# Altium schematic sheet Main.SchDoc
size A3; DocumentNumber: 1; SheetNumber: 1; SheetTotal: 11
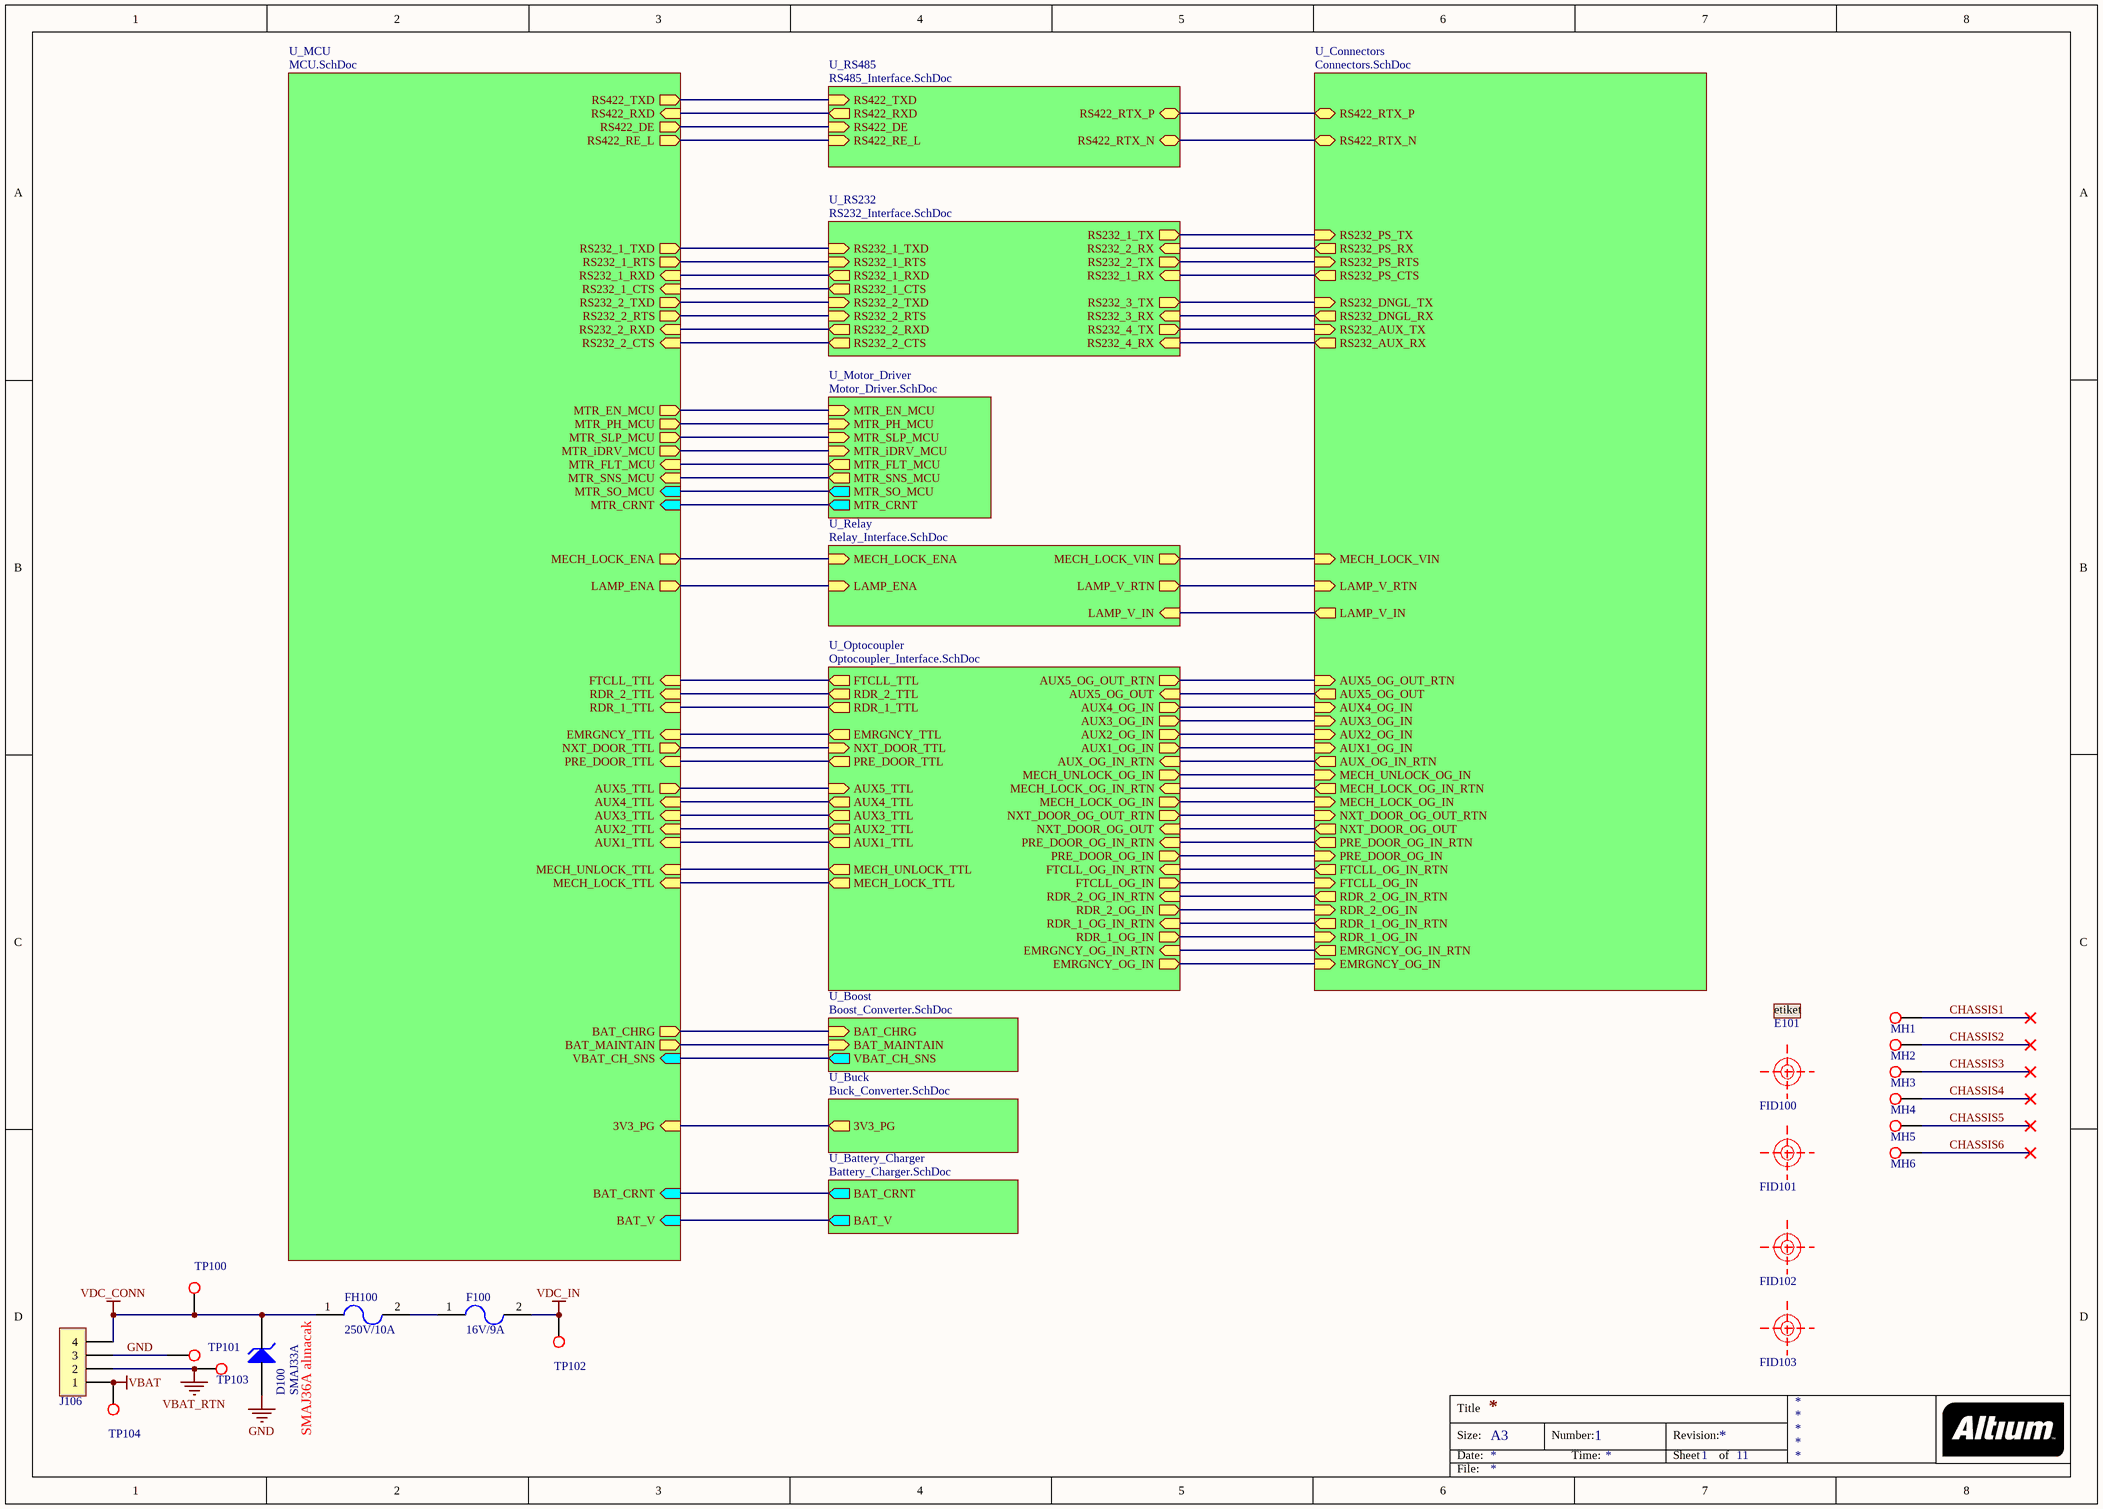
[diagram p0: Main.SchDoc]

## Parts
D100  SMAJ33A  [DIOM5226X23N]
E101  14x07 mm  [AEME-1407-0000-N000]  (value not drawn)
F100  16V/9A  [AE12-000M-T000-9090]
FH100  250V/10A  [AE15-000T-0000-0001]
FID100  Fiducial  [FIDUCIAL_R1MM0]  (value not drawn)
FID101  Fiducial  [FIDUCIAL_R1MM0]  (value not drawn)
FID102  Fiducial  [FIDUCIAL_R1MM0]  (value not drawn)
FID103  Fiducial  [FIDUCIAL_R1MM0]  (value not drawn)
J106  (no value)  [AJ61-1004-TAPR-RNS0]
MH1  AEMT-C00S-1000-0000  [TP100]  (value not drawn)
MH2  AEMT-C00S-1000-0000  [TP100]  (value not drawn)
MH3  AEMT-C00S-1000-0000  [TP100]  (value not drawn)
MH4  AEMT-C00S-1000-0000  [TP100]  (value not drawn)
MH5  AEMT-C00S-1000-0000  [TP100]  (value not drawn)
MH6  AEMT-C00S-1000-0000  [TP100]  (value not drawn)
TP100  AEMT-C00S-1000-0000  [TP100]  (value not drawn)
TP101  AEMT-C00S-1000-0000  [TP100]  (value not drawn)
TP102  AEMT-C00S-1000-0000  [TP100]  (value not drawn)
TP103  AEMT-C00S-1000-0000  [TP100]  (value not drawn)
TP104  AEMT-C00S-1000-0000  [TP100]  (value not drawn)

## Sub-sheets
U_Battery_Charger = Battery_Charger.SchDoc: BAT_CRNT (out), BAT_V (out)
U_Boost = Boost_Converter.SchDoc: BAT_CHRG (in), BAT_MAINTAIN (in), VBAT_CH_SNS (out)
U_Buck = Buck_Converter.SchDoc: 3V3_PG (out)
U_Connectors = Connectors.SchDoc: RS232_DNGL_TX (in), RS232_DNGL_RX (out), RS232_PS_TX (in), RS232_PS_RX (out), RS232_PS_CTS (out), RS232_PS_RTS (in), MECH_LOCK_VIN (in), MECH_LOCK_OG_IN (in), MECH_LOCK_OG_IN_RTN (out), MECH_UNLOCK_OG_IN (in), EMRGNCY_OG_IN (in), EMRGNCY_OG_IN_RTN (out), PRE_DOOR_OG_IN (in), PRE_DOOR_OG_IN_RTN (out), NXT_DOOR_OG_OUT (out), NXT_DOOR_OG_OUT_RTN (in), RDR_1_OG_IN (in), RDR_1_OG_IN_RTN (out), RDR_2_OG_IN (in), RDR_2_OG_IN_RTN (out), FTCLL_OG_IN (in), FTCLL_OG_IN_RTN (out), LAMP_V_RTN (in), LAMP_V_IN (out), AUX1_OG_IN (in), AUX_OG_IN_RTN (out), AUX2_OG_IN (in), AUX3_OG_IN (in), AUX4_OG_IN (in), AUX5_OG_OUT (out), AUX5_OG_OUT_RTN (in), RS422_RTX_P (bidir), RS422_RTX_N (bidir), RS232_AUX_TX (in), RS232_AUX_RX (out)
U_MCU = MCU.SchDoc: MECH_LOCK_ENA (out), LAMP_ENA (out), EMRGNCY_TTL (in), RDR_1_TTL (in), RDR_2_TTL (in), FTCLL_TTL (in), AUX1_TTL (in), AUX2_TTL (in), AUX3_TTL (in), PRE_DOOR_TTL (in), NXT_DOOR_TTL (out), MECH_LOCK_TTL (in), MECH_UNLOCK_TTL (in), AUX4_TTL (in), AUX5_TTL (out), MTR_EN_MCU (out), MTR_PH_MCU (out), MTR_SLP_MCU (out), MTR_iDRV_MCU (out), MTR_FLT_MCU (in), MTR_SNS_MCU (in), MTR_SO_MCU (in), MTR_CRNT (in), RS232_1_TXD (out), RS232_1_RTS (out), RS232_1_RXD (in), RS232_1_CTS (in), RS422_TXD (out), RS422_RXD (in), RS422_DE (out), RS422_RE_L (out), BAT_CHRG (out), BAT_MAINTAIN (out), VBAT_CH_SNS (in), BAT_CRNT (in), BAT_V (in), 3V3_PG (in), RS232_2_CTS (in), RS232_2_RXD (in), RS232_2_RTS (out), RS232_2_TXD (out)
U_Motor_Driver = Motor_Driver.SchDoc: MTR_EN_MCU (in), MTR_PH_MCU (in), MTR_SLP_MCU (in), MTR_iDRV_MCU (in), MTR_FLT_MCU (out), MTR_SNS_MCU (out), MTR_SO_MCU (out), MTR_CRNT (out)
U_Optocoupler = Optocoupler_Interface.SchDoc: EMRGNCY_OG_IN (out), EMRGNCY_OG_IN_RTN (in), RDR_1_OG_IN (out), RDR_1_OG_IN_RTN (in), RDR_2_OG_IN (out), RDR_2_OG_IN_RTN (in), FTCLL_OG_IN (out), FTCLL_OG_IN_RTN (in), PRE_DOOR_OG_IN (out), PRE_DOOR_OG_IN_RTN (in), NXT_DOOR_OG_OUT (in), NXT_DOOR_OG_OUT_RTN (out), MECH_LOCK_OG_IN (out), MECH_LOCK_OG_IN_RTN (in), PRE_DOOR_TTL (out), NXT_DOOR_TTL (in), MECH_LOCK_TTL (out), EMRGNCY_TTL (out), RDR_1_TTL (out), RDR_2_TTL (out), FTCLL_TTL (out), MECH_UNLOCK_OG_IN (out), MECH_UNLOCK_TTL (out), AUX1_OG_IN (out), AUX_OG_IN_RTN (in), AUX1_TTL (out), AUX2_OG_IN (out), AUX2_TTL (out), AUX3_OG_IN (out), AUX3_TTL (out), AUX4_OG_IN (out), AUX4_TTL (out), AUX5_OG_OUT (in), AUX5_OG_OUT_RTN (out), AUX5_TTL (in)
U_Relay = Relay_Interface.SchDoc: MECH_LOCK_VIN (out), MECH_LOCK_ENA (in), LAMP_V_RTN (out), LAMP_ENA (in), LAMP_V_IN (in)
U_RS232 = RS232_Interface.SchDoc: RS232_1_TX (out), RS232_2_TX (out), RS232_1_RX (in), RS232_2_RX (in), RS232_1_TXD (in), RS232_1_RTS (in), RS232_1_RXD (out), RS232_1_CTS (out), RS232_3_TX (out), RS232_4_TX (out), RS232_3_RX (in), RS232_4_RX (in), RS232_2_TXD (in), RS232_2_RTS (in), RS232_2_RXD (out), RS232_2_CTS (out)
U_RS485 = RS485_Interface.SchDoc: RS422_TXD (in), RS422_RXD (out), RS422_DE (in), RS422_RE_L (in), RS422_RTX_P (bidir), RS422_RTX_N (bidir)

## Nets
GND: D100.2(A) J106.3 TP101.1
VBAT: J106.1 TP104.1
VBAT_RTN: J106.2 TP103.1
VDC_CONN: D100.1(K) FH100.1 J106.4 TP100.1
VDC_IN: F100.2 TP102.1
CHASSIS1: MH1.1
CHASSIS2: MH2.1
CHASSIS3: MH3.1
CHASSIS4: MH4.1
CHASSIS5: MH5.1
CHASSIS6: MH6.1
NetF100_1: F100.1 FH100.2
(unnamed): sheet U_Motor_Driver/MTR_EN_MCU, sheet U_MCU/MTR_EN_MCU
(unnamed): sheet U_Motor_Driver/MTR_PH_MCU, sheet U_MCU/MTR_PH_MCU
(unnamed): sheet U_Motor_Driver/MTR_SLP_MCU, sheet U_MCU/MTR_SLP_MCU
(unnamed): sheet U_Motor_Driver/MTR_iDRV_MCU, sheet U_MCU/MTR_iDRV_MCU
(unnamed): sheet U_Motor_Driver/MTR_FLT_MCU, sheet U_MCU/MTR_FLT_MCU
(unnamed): sheet U_Motor_Driver/MTR_SNS_MCU, sheet U_MCU/MTR_SNS_MCU
(unnamed): sheet U_Motor_Driver/MTR_SO_MCU, sheet U_MCU/MTR_SO_MCU
(unnamed): sheet U_Motor_Driver/MTR_CRNT, sheet U_MCU/MTR_CRNT
(unnamed): sheet U_RS232/RS232_1_TX, sheet U_Connectors/RS232_PS_TX
(unnamed): sheet U_RS232/RS232_2_TX, sheet U_Connectors/RS232_PS_RTS
(unnamed): sheet U_RS232/RS232_1_RX, sheet U_Connectors/RS232_PS_CTS
(unnamed): sheet U_RS232/RS232_2_RX, sheet U_Connectors/RS232_PS_RX
(unnamed): sheet U_RS232/RS232_1_TXD, sheet U_MCU/RS232_1_TXD
(unnamed): sheet U_RS232/RS232_1_RTS, sheet U_MCU/RS232_1_RTS
(unnamed): sheet U_RS232/RS232_1_RXD, sheet U_MCU/RS232_1_RXD
(unnamed): sheet U_RS232/RS232_1_CTS, sheet U_MCU/RS232_1_CTS
(unnamed): sheet U_RS232/RS232_3_TX, sheet U_Connectors/RS232_DNGL_TX
(unnamed): sheet U_RS232/RS232_4_TX, sheet U_Connectors/RS232_AUX_TX
(unnamed): sheet U_RS232/RS232_3_RX, sheet U_Connectors/RS232_DNGL_RX
(unnamed): sheet U_RS232/RS232_4_RX, sheet U_Connectors/RS232_AUX_RX
(unnamed): sheet U_RS232/RS232_2_TXD, sheet U_MCU/RS232_2_TXD
(unnamed): sheet U_RS232/RS232_2_RTS, sheet U_MCU/RS232_2_RTS
(unnamed): sheet U_RS232/RS232_2_RXD, sheet U_MCU/RS232_2_RXD
(unnamed): sheet U_RS232/RS232_2_CTS, sheet U_MCU/RS232_2_CTS
(unnamed): sheet U_RS485/RS422_TXD, sheet U_MCU/RS422_TXD
(unnamed): sheet U_RS485/RS422_RXD, sheet U_MCU/RS422_RXD
(unnamed): sheet U_RS485/RS422_DE, sheet U_MCU/RS422_DE
(unnamed): sheet U_RS485/RS422_RE_L, sheet U_MCU/RS422_RE_L
(unnamed): sheet U_RS485/RS422_RTX_P, sheet U_Connectors/RS422_RTX_P
(unnamed): sheet U_RS485/RS422_RTX_N, sheet U_Connectors/RS422_RTX_N
(unnamed): sheet U_Optocoupler/EMRGNCY_OG_IN, sheet U_Connectors/EMRGNCY_OG_IN
(unnamed): sheet U_Optocoupler/EMRGNCY_OG_IN_RTN, sheet U_Connectors/EMRGNCY_OG_IN_RTN
(unnamed): sheet U_Optocoupler/RDR_1_OG_IN, sheet U_Connectors/RDR_1_OG_IN
(unnamed): sheet U_Optocoupler/RDR_1_OG_IN_RTN, sheet U_Connectors/RDR_1_OG_IN_RTN
(unnamed): sheet U_Optocoupler/RDR_2_OG_IN, sheet U_Connectors/RDR_2_OG_IN
(unnamed): sheet U_Optocoupler/RDR_2_OG_IN_RTN, sheet U_Connectors/RDR_2_OG_IN_RTN
(unnamed): sheet U_Optocoupler/FTCLL_OG_IN, sheet U_Connectors/FTCLL_OG_IN
(unnamed): sheet U_Optocoupler/FTCLL_OG_IN_RTN, sheet U_Connectors/FTCLL_OG_IN_RTN
(unnamed): sheet U_Optocoupler/PRE_DOOR_OG_IN, sheet U_Connectors/PRE_DOOR_OG_IN
(unnamed): sheet U_Optocoupler/PRE_DOOR_OG_IN_RTN, sheet U_Connectors/PRE_DOOR_OG_IN_RTN
(unnamed): sheet U_Optocoupler/NXT_DOOR_OG_OUT, sheet U_Connectors/NXT_DOOR_OG_OUT
(unnamed): sheet U_Optocoupler/NXT_DOOR_OG_OUT_RTN, sheet U_Connectors/NXT_DOOR_OG_OUT_RTN
(unnamed): sheet U_Optocoupler/MECH_LOCK_OG_IN, sheet U_Connectors/MECH_LOCK_OG_IN
(unnamed): sheet U_Optocoupler/MECH_LOCK_OG_IN_RTN, sheet U_Connectors/MECH_LOCK_OG_IN_RTN
(unnamed): sheet U_Optocoupler/PRE_DOOR_TTL, sheet U_MCU/PRE_DOOR_TTL
(unnamed): sheet U_Optocoupler/NXT_DOOR_TTL, sheet U_MCU/NXT_DOOR_TTL
(unnamed): sheet U_Optocoupler/MECH_LOCK_TTL, sheet U_MCU/MECH_LOCK_TTL
(unnamed): sheet U_Optocoupler/EMRGNCY_TTL, sheet U_MCU/EMRGNCY_TTL
(unnamed): sheet U_Optocoupler/RDR_1_TTL, sheet U_MCU/RDR_1_TTL
(unnamed): sheet U_Optocoupler/RDR_2_TTL, sheet U_MCU/RDR_2_TTL
(unnamed): sheet U_Optocoupler/FTCLL_TTL, sheet U_MCU/FTCLL_TTL
(unnamed): sheet U_Optocoupler/MECH_UNLOCK_OG_IN, sheet U_Connectors/MECH_UNLOCK_OG_IN
(unnamed): sheet U_Optocoupler/MECH_UNLOCK_TTL, sheet U_MCU/MECH_UNLOCK_TTL
(unnamed): sheet U_Optocoupler/AUX1_OG_IN, sheet U_Connectors/AUX1_OG_IN
(unnamed): sheet U_Optocoupler/AUX_OG_IN_RTN, sheet U_Connectors/AUX_OG_IN_RTN
(unnamed): sheet U_Optocoupler/AUX1_TTL, sheet U_MCU/AUX1_TTL
(unnamed): sheet U_Optocoupler/AUX2_OG_IN, sheet U_Connectors/AUX2_OG_IN
(unnamed): sheet U_Optocoupler/AUX2_TTL, sheet U_MCU/AUX2_TTL
(unnamed): sheet U_Optocoupler/AUX3_OG_IN, sheet U_Connectors/AUX3_OG_IN
(unnamed): sheet U_Optocoupler/AUX3_TTL, sheet U_MCU/AUX3_TTL
(unnamed): sheet U_Optocoupler/AUX4_OG_IN, sheet U_Connectors/AUX4_OG_IN
(unnamed): sheet U_Optocoupler/AUX4_TTL, sheet U_MCU/AUX4_TTL
(unnamed): sheet U_Optocoupler/AUX5_OG_OUT, sheet U_Connectors/AUX5_OG_OUT
(unnamed): sheet U_Optocoupler/AUX5_OG_OUT_RTN, sheet U_Connectors/AUX5_OG_OUT_RTN
(unnamed): sheet U_Optocoupler/AUX5_TTL, sheet U_MCU/AUX5_TTL
(unnamed): sheet U_MCU/MECH_LOCK_ENA, sheet U_Relay/MECH_LOCK_ENA
(unnamed): sheet U_MCU/LAMP_ENA, sheet U_Relay/LAMP_ENA
(unnamed): sheet U_MCU/BAT_CHRG, sheet U_Boost/BAT_CHRG
(unnamed): sheet U_MCU/BAT_MAINTAIN, sheet U_Boost/BAT_MAINTAIN
(unnamed): sheet U_MCU/VBAT_CH_SNS, sheet U_Boost/VBAT_CH_SNS
(unnamed): sheet U_MCU/BAT_CRNT, sheet U_Battery_Charger/BAT_CRNT
(unnamed): sheet U_MCU/BAT_V, sheet U_Battery_Charger/BAT_V
(unnamed): sheet U_MCU/3V3_PG, sheet U_Buck/3V3_PG
(unnamed): sheet U_Relay/MECH_LOCK_VIN, sheet U_Connectors/MECH_LOCK_VIN
(unnamed): sheet U_Relay/LAMP_V_RTN, sheet U_Connectors/LAMP_V_RTN
(unnamed): sheet U_Relay/LAMP_V_IN, sheet U_Connectors/LAMP_V_IN

## Notes on the sheet
- SMAJ36A alınacak
- Title
- Size:
- Date:
- A3
- Number:
- Time:
- Revision:
- Sheet
- of
- File:
- (in symbol AEME-1407-0000-N000) etiket

## Library data of the parts
D100 = AS1H-975M-SI60-0001: Diode, TVS, 3.5V @35A, 33V, 400W,  Uni-directional, DO-214AC; Manufacturer Part Number: SMAJ33A-13-F; Manufacturer: Diodes; CR: 000065/122; DS: 000065; Lead Finish: Pb Free; Published by: MU; Requested by: NK; Price: *; Definition Date: 22.03.2013; Footprint Type: SMD; JEDEC Code: *; Operating Temp: -55 to 150 C; Package Reference: DO-214AC; Revision Date: *; Status: Active; Storage Temp: -55 to 175 C; Supplier: *; Supplier Part Number: *; Component Type: DIODE; Forward Voltage: 3.5V @35A; Reverse Voltage: 33 V; Value: SMAJ33A
E101 = AEME-1407-0000-N000: PCB Label, 14x07mm, Non-Conductive; Boyut: 14x07 mm
F100 = AE12-000M-T000-9090: Resettable Fuse, 16V, 9A, TH, Radial; Manufacturer: Littlefuse; Manufacturer Part Number: 16R900GF; Published By: NK; CR: *; DS: -; Definition Date: 03.08.2015; Operating Temp: -40 °C to +85 °C; Footprint Type: TH; Revision: *; Revision Date: -; Lead Finish: *; Status: Active; Storage Temp: -40 °C to +85 °C; Component Type: Fuse; JEDEC Code: *; Package Reference: -; Price: *; Requested By: NK; Supplier: *; Supplier Part Number: *; Current Rating: 9A; Max. Operating Voltage: 16V; Value: 16V/9A
FH100 = AE15-000T-0000-0001: Fuse block, TH, 5x20mm; Manufacturer: Littlefuse; Manufacturer Part Number: 65600001009; Published By: NK; Current Rating: 10; Max. Operating Voltage: 250V; CR: *; DS: -; Definition Date: 08.08.2015; Operating Temp: -40 °C to +85 °C; Footprint Type: TH; Revision: *; Revision Date: -; Lead Finish: *; Status: Active; Storage Temp: -40 °C to +85 °C; Component Type: Fuse; JEDEC Code: *; Package Reference: -; Price: *; Requested By: NK; Supplier: *; Supplier Part Number: *; Value: 250V/10A
FID100-FID103 = FIDUCIAL_R1MM0: Fiducial, Round, 1mm; Published By: MAY; Definition Date: 24.05.2012; Height: 0; Revision: 0; Component Type: Fiducial
J106 = AJ61-1004-TAPR-RNS0: CON, Terminal, Klemens, 4 Pins, 1-Row, 5.08mm, TH, P, R; Manufacturer: ON-SHORE; Manufacturer Part Number: OSTOQ045451; Requested by: NK; Lead Finish: Pb Free; Max. Operating Voltage: 250VAC; Rated Current: 15A; CR: -; Definition Date: 11.08.2015; Revision Date: *; Price: *; Supplier: *; Supplier Part Number: *; DS: -; Operating Temp: -30, +105; Storage Temp: -30, +105; Status: Active; Package Reference: *; Component Type: Connector; Footprint Type: TH; Published by: NK; JEDEC Code: *; Material: *
MH1-MH6 TP100-TP104 = AEMT-C00S-1000-0000: Test Point, Circular, 1mm; Text: TEST_POINT